# EAGLE design RoboticArm3dPrinter (EAGLE 9.5.1)
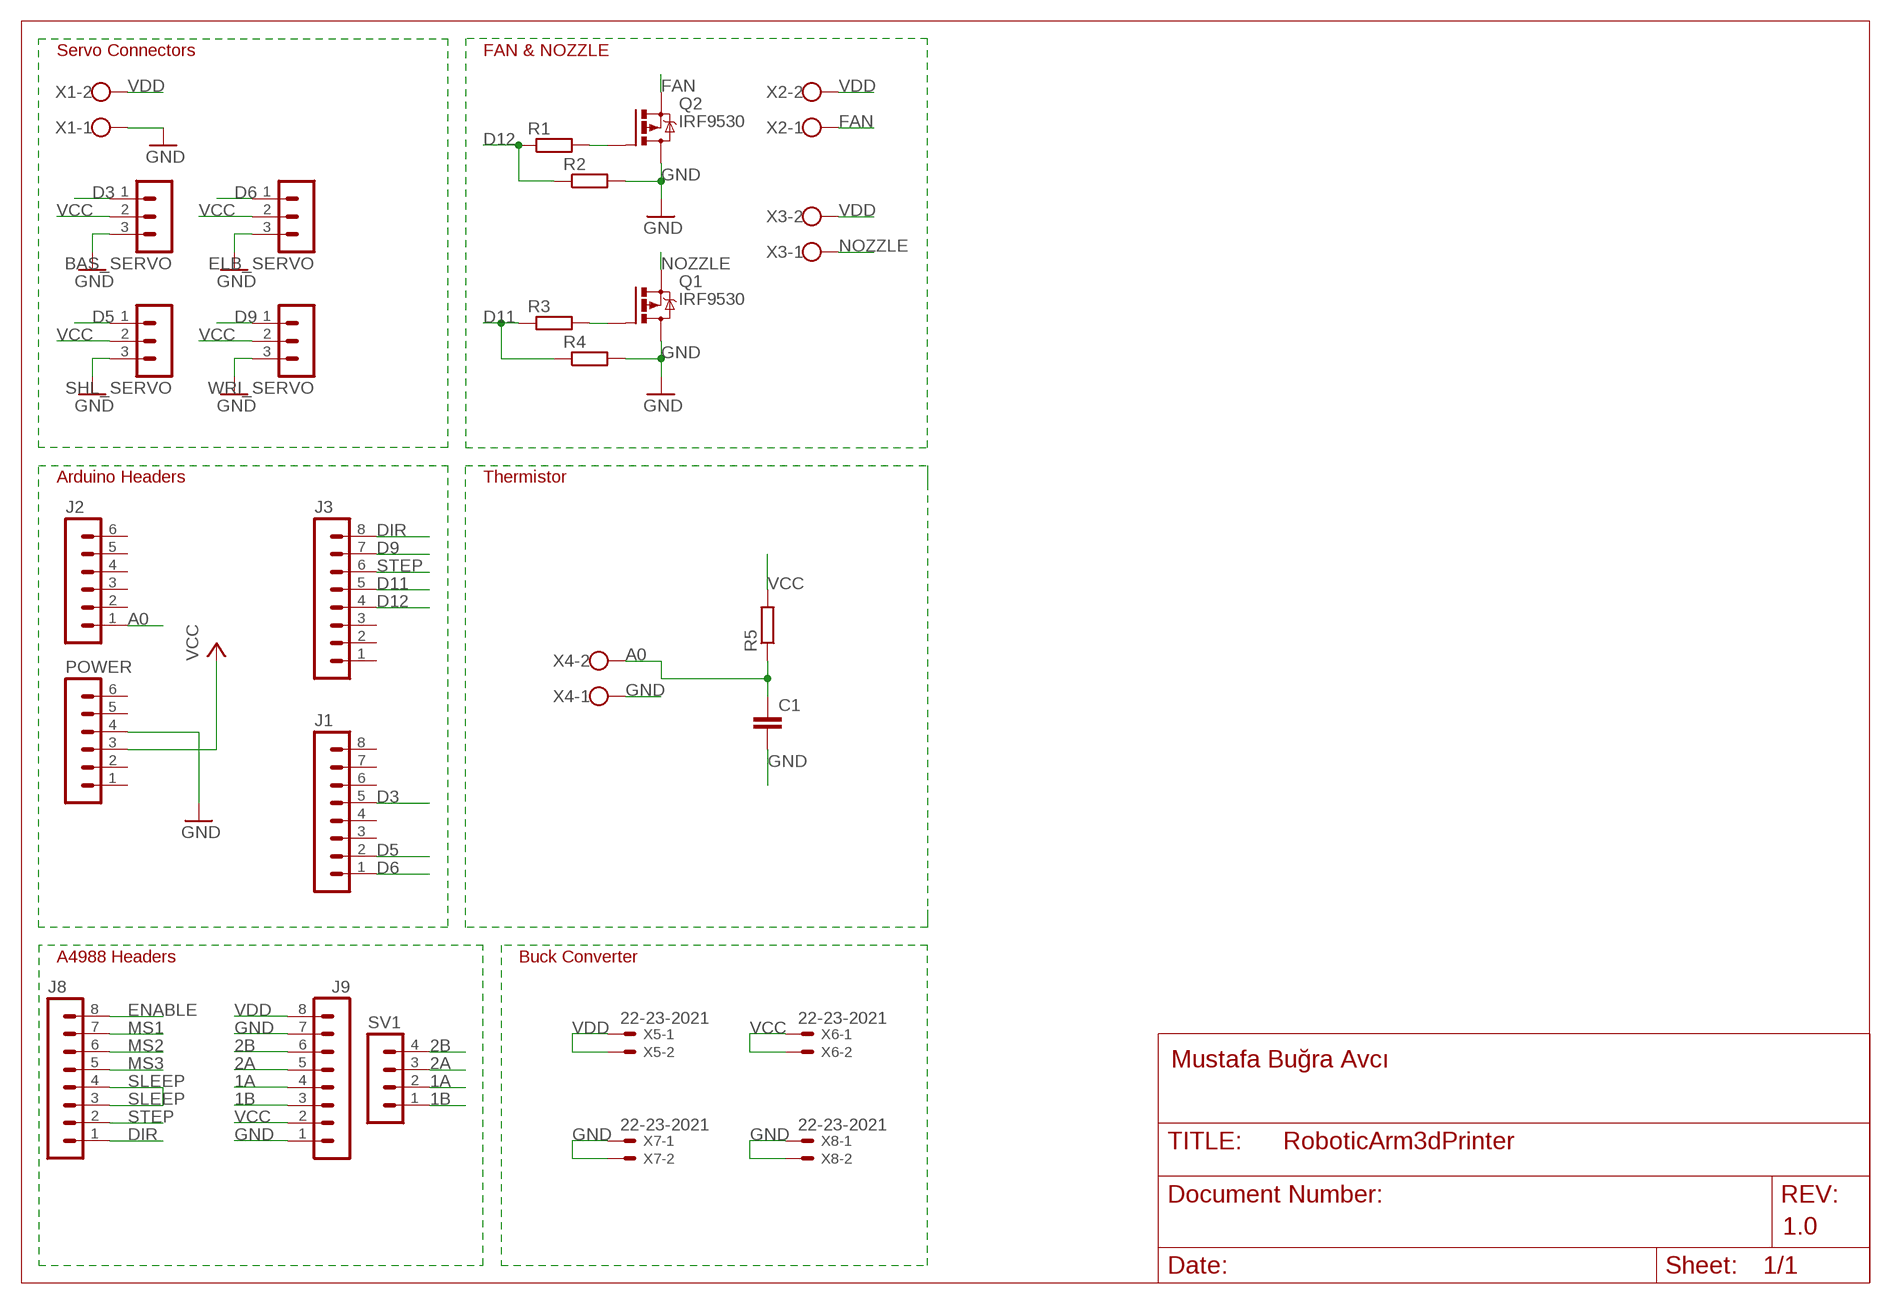
[diagram p0: schematic, sheet 1]

## Parts
BAS_SERVO  MA03-1  [MA03-1]
C1  C5/2.5  [C5B2.5]
ELB_SERVO  MA03-1  [MA03-1]
J1  MA08-1  [MA08-1]
J2  MA06-1  [MA06-1]
J3  MA08-1  [MA08-1]
J8  MA08-1  [MA08-1]
J9  MA08-1  [MA08-1]
POWER  MA06-1  [MA06-1]
Q1  IRF9530  [TO220BV]
Q2  IRF9530  [TO220BV]
R1  R-EU_0207/10  [0207/10]
R2  R-EU_0207/10  [0207/10]
R3  R-EU_0207/10  [0207/10]
R4  R-EU_0207/10  [0207/10]
R5  R-EU_0207/10  [0207/10]
SHL_SERVO  MA03-1  [MA03-1]
SV1  MA04-1  [MA04-1]
WRI_SERVO  MA03-1  [MA03-1]
X1  W237-102  [W237-102]
X2  W237-102  [W237-102]
X3  W237-102  [W237-102]
X4  W237-102  [W237-102]
X5  22-23-2021  [22-23-2021]
X6  22-23-2021  [22-23-2021]
X7  22-23-2021  [22-23-2021]
X8  22-23-2021  [22-23-2021]

## Nets
1A: J9.4 SV1.2
1B: J9.3 SV1.1
2A: J9.5 SV1.3
2B: J9.6 SV1.4
A0: C1.1 J2.1 R5.1 X4.2
D3: BAS_SERVO.1 J1.5
D5: J1.2 SHL_SERVO.1
D6: ELB_SERVO.1 J1.1
D9: J3.7 WRI_SERVO.1
D11: J3.5 R3.1 R4.1
D12: J3.4 R1.1 R2.1
DIR: J3.8 J8.1
ENABLE: J8.8
FAN: Q2.S X2.1
GND: BAS_SERVO.3 C1.2 ELB_SERVO.3 J9.1 J9.7 POWER.4 Q1.D Q2.D R2.2 R4.2 SHL_SERVO.3 WRI_SERVO.3 X1.1 X4.1 X7.1 X7.2 X8.1 X8.2
MS1: J8.7
MS2: J8.6
MS3: J8.5
N$1: Q1.G R3.2
N$2: Q2.G R1.2
NOZZLE: Q1.S X3.1
SLEEP: J8.3 J8.4
STEP: J3.6 J8.2
VCC: BAS_SERVO.2 ELB_SERVO.2 J9.2 POWER.3 R5.2 SHL_SERVO.2 WRI_SERVO.2 X6.1 X6.2
VDD: J9.8 X1.2 X2.2 X3.2 X5.1 X5.2
Unconnected: J1.3 J1.4 J1.6 J1.7 J1.8 J2.2 J2.3 J2.4 J2.5 J2.6 J3.1 J3.2 J3.3 POWER.1 POWER.2 POWER.5 POWER.6

## Notes on the sheet
- Servo Connectors | FAN & NOZZLE
- Arduino Headers | Thermistor
- A4988 Headers | Buck Converter
- Mustafa Buğra Avcı
- 1.0

## Library data of the parts
BAS_SERVO ELB_SERVO SHL_SERVO WRI_SERVO = con-lstb:MA03-1: PIN HEADER
C1 = capacitor-wima:C: CAPACITOR naming: grid - package width
J1 J3 J8 J9 = con-lstb:MA08-1: PIN HEADER
J2 POWER = con-lstb:MA06-1: PIN HEADER
Q1 Q2 = transistor-power:IRF9530: P-CHANNEL HEXFET POWER-MOS-FET Source: http://www.irf.com/product-info/datasheets/data/irf9530.pdf
R1-R5 = rcl:R-EU_: RESISTOR, European symbol; SPICEPREFIX: R
SV1 = con-lstb:MA04-1: PIN HEADER; OC_FARNELL: unknown; OC_NEWARK: unknown
X1-X4 = con-wago-500:W237-102: WAGO SCREW CLAMP
X5-X8 = con-molex:22-23-2021: .100" (2.54mm) Center Header - 2 Pin; MF: MOLEX; MPN: 22-23-2021; OC_FARNELL: 1462926; OC_NEWARK: 25C3832

## Net classes
0 default: width 0.254 mm, drill 0.305 mm, clearance 0.152 mm

## Board
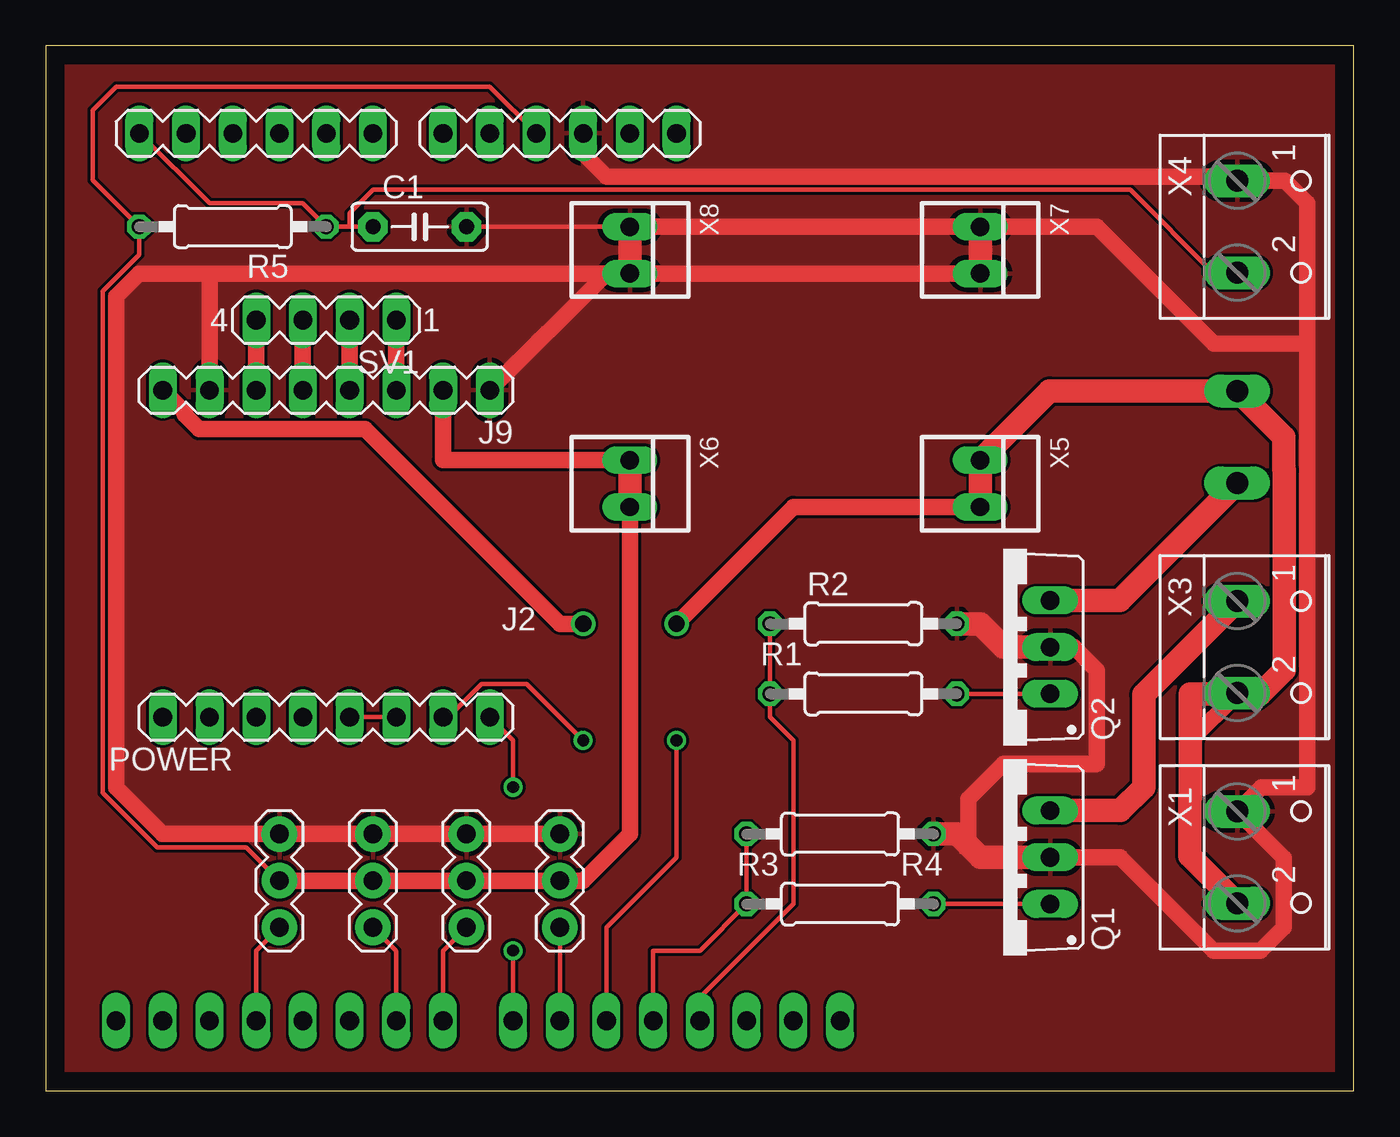
[diagram p1: board, top side]
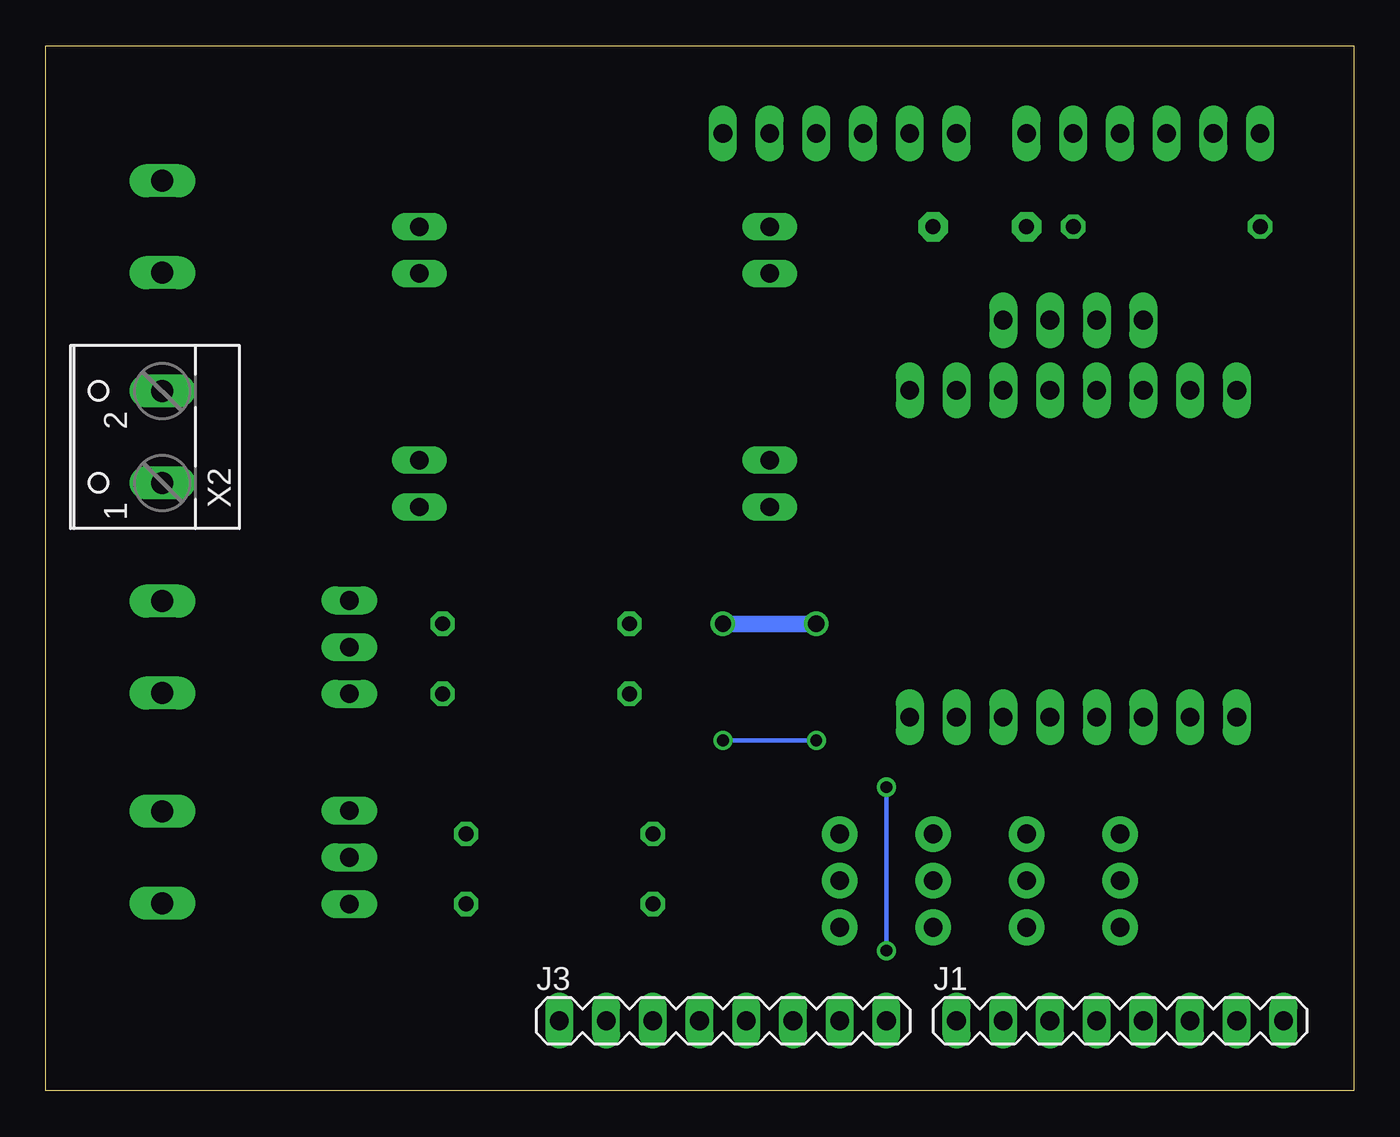
[diagram p2: board, bottom side, seen from below]

Size 71.1 x 56.82 mm. Coordinates in mm from the lower left corner, seen from the top.
Outline: 0,0 71.1,0 71.1,56.82 0,56.82 0,0
Copper layers (1*16): Top 0.035mm / dielectric 1.5mm / Bottom 0.035mm
Design rules "default": minimum track width 6mil, minimum drill 0.35mm, track to track 6mil, track to pad 6mil, pad to pad 6mil, via to via 6mil, smd to smd 6mil, copper to edge 40mil, drill to drill 6mil, minimum pad ring 10mil, minimum via ring 8mil, stop-mask expansion 4mil, vias tented up to drill 0mil, thermal gap 10mil

### Footprints (pad centres in the part's own frame; a part is rotated, then mirrored left to right if it is on the bottom)
MA03-1 = drill 1.016 pad 1.93: 1 -2.54,0; 2 0,0; 3 2.54,0
C5B2.5 = drill 0.813 pad 1.6 octagon: 1 -2.54,0; 2 2.54,0
MA08-1 = drill 1.016 long: 1 -8.89,0; 2 -6.35,0; 3 -3.81,0; 4 -1.27,0; 5 1.27,0; 6 3.81,0; 7 6.35,0; 8 8.89,0
MA06-1 = drill 1.016 long: 1 -6.35,0; 2 -3.81,0; 3 -1.27,0; 4 1.27,0; 5 3.81,0; 6 6.35,0
TO220BV = drill 1.016 long: D 0,-2.54; G -2.54,-2.54; S 2.54,-2.54
0207/10 = drill 0.813 octagon: 1 -5.08,0; 2 5.08,0
MA04-1 = drill 1.016 long: 1 -3.81,0; 2 -1.27,0; 3 1.27,0; 4 3.81,0
W237-102 = drill 1.194 long: 1 -2.5,-1.27; 2 2.5,-1.27
22-23-2021 = drill 1 long: 1 -1.27,0; 2 1.27,0

### Placement (x,y rotation side)
BAS_SERVO  12.7,11.43 90 top
C1  20.32,46.99 0 top
ELB_SERVO  22.86,11.43 90 top
J1  12.7,3.81 0 bottom
J2  11.43,52.07 0 top
J3  34.29,3.81 0 bottom
J8  15.24,20.32 180 top
J9  15.24,38.1 180 top
POWER  27.94,52.07 0 top
Q1  52.07,12.7 90 top
Q2  52.07,24.13 90 top
R1  44.45,21.59 0 top
R2  44.45,25.4 0 top
R3  43.18,10.16 0 top
R4  43.18,13.97 0 top
R5  10.16,46.99 180 top
SHL_SERVO  17.78,11.43 90 top
SV1  15.24,41.91 180 top
WRI_SERVO  27.94,11.43 90 top
X1  66.04,12.7 270 top
X2  66.04,35.56 90 bottom
X3  66.04,24.13 270 top
X4  66.04,46.99 270 top
X5  50.8,33.02 270 top
X6  31.75,33.02 270 top
X7  50.8,45.72 270 top
X8  31.75,45.72 270 top

### Tracks (layer width: path | path; a pad name or v marks a point on that pad's centre or on a via)
1A
  Top 0.889: J9.4 SV1.2
1B
  Top 0.889: J9.3 SV1.1
2A
  Top 0.889: J9.5 SV1.3
2B
  Top 0.889: SV1.4 J9.6
A0
  Top 0.254: 16.51,46.99 R5.1 13.97,48.26 8.89,48.26 J2.1 | 16.51,46.99 C1.1 | X4.2 63.46,44.49 58.95,49 17.78,49 16.51,47.73 16.51,46.99
D3
  Top 0.254: BAS_SERVO.1 11.43,7.62 J1.5
D5
  Top 0.254: SHL_SERVO.1 19.05,7.62 J1.2
D6
  Top 0.254: ELB_SERVO.1 21.59,7.62 J1.1
D9
  Top 0.254: WRI_SERVO.1 J3.7
D11
  Top 0.254: J3.5 33.02,7.62 35.56,7.62 R3.1 R4.1
D12
  Top 0.254: J3.4 35.56,5.08 40.64,10.16 40.64,19.05 39.37,20.32 R1.1 R2.1
DIR  (via drill 0.64)
  Top 0.254: J8.1 25.4,19.05 v25.4,16.51 | v25.4,7.62 J3.8
  Bottom 0.254: v25.4,16.51 v25.4,7.62
FAN
  Top 1.27: X2.1 58.38,26.67 Q2.S
GND
  Top 0.254: C1.2 X8.1
  Top 0.889: POWER.4 29.21,50.99 30.48,49.72 64.54,49.72 X4.1 67.35,49.49 68.58,48.26 68.58,40.64 | J9.1 30.48,44.45 X8.2 | J9.7 8.89,44.45 | 8.89,44.45 X8.2 | WRI_SERVO.3 ELB_SERVO.3 SHL_SERVO.3 BAS_SERVO.3 6.35,13.97 3.81,16.51 3.81,43.18 5.08,44.45 8.89,44.45 | 68.58,40.64 68.58,16.51 66.08,16.51 X1.1 67.31,12.66 67.31,8.89 66.04,7.62 63.5,7.62 58.42,12.7 Q1.D | 68.58,40.64 63.5,40.64 57.15,46.99 X7.1 X8.1 | Q2.D 55.88,24.13 57.15,22.86 57.15,17.78 52.07,17.78 50.16,15.88 50.16,13.34 | X8.2 X7.2
  Top 1.27: R2.2 50.8,25.4 52.07,24.13 Q2.D | R4.2 49.53,13.97 50.16,13.34 50.8,12.7 Q1.D | X8.1 X8.2 | X7.1 X7.2
  pour Top: 0,57.15 0,0 71.12,0 71.12,57.15
N$1
  Top 0.254: Q1.G R3.2
N$2
  Top 0.254: Q2.G R1.2
NOZZLE
  Top 1.27: X3.1 59.69,21.55 59.69,16.51 58.42,15.24 Q1.S
SLEEP
  Top 0.254: J8.3 J8.4
STEP  (via drill 0.64)
  Top 0.254: J8.2 21.89,20.32 23.7,22.12 26.14,22.12 v29.21,19.05 | v34.29,19.05 34.29,12.7 30.48,8.89 J3.6
  Bottom 0.254: v29.21,19.05 v34.29,19.05
VCC
  Top 0.254: POWER.3 24.13,54.61 3.81,54.61 2.54,53.34 2.54,49.53 R5.2 5.08,45.47 3.09,43.48 3.09,16.21 6.05,13.25 10.88,13.25 BAS_SERVO.2
  Top 0.889: J9.2 21.59,34.29 X6.1 | BAS_SERVO.2 SHL_SERVO.2 ELB_SERVO.2 WRI_SERVO.2 29.21,11.43 31.75,13.97 X6.2
  Top 1.27: X6.1 X6.2
VDD  (via drill 0.89)
  Top 0.889: J9.8 7.53,36.92 7.53,36.77 8.33,35.98 17.36,35.98 27.94,25.4 v29.21,25.4 | v34.29,25.4 40.64,31.75 X5.2 | X3.2 64.77,21.59 62.23,19.05
  Top 1.27: X5.2 X5.1 54.57,38.06 X2.2 64.81,38.06 67.31,35.56 67.31,33.8 67.35,33.76 67.35,22.9 66.04,21.59 62.23,21.59 62.23,19.05 62.23,15.94 62.19,15.9 62.19,12.78 X1.2
  Bottom 0.889: v29.21,25.4 v34.29,25.4